# EAGLE board POE_REGULADORES (EAGLE 9.6.2)
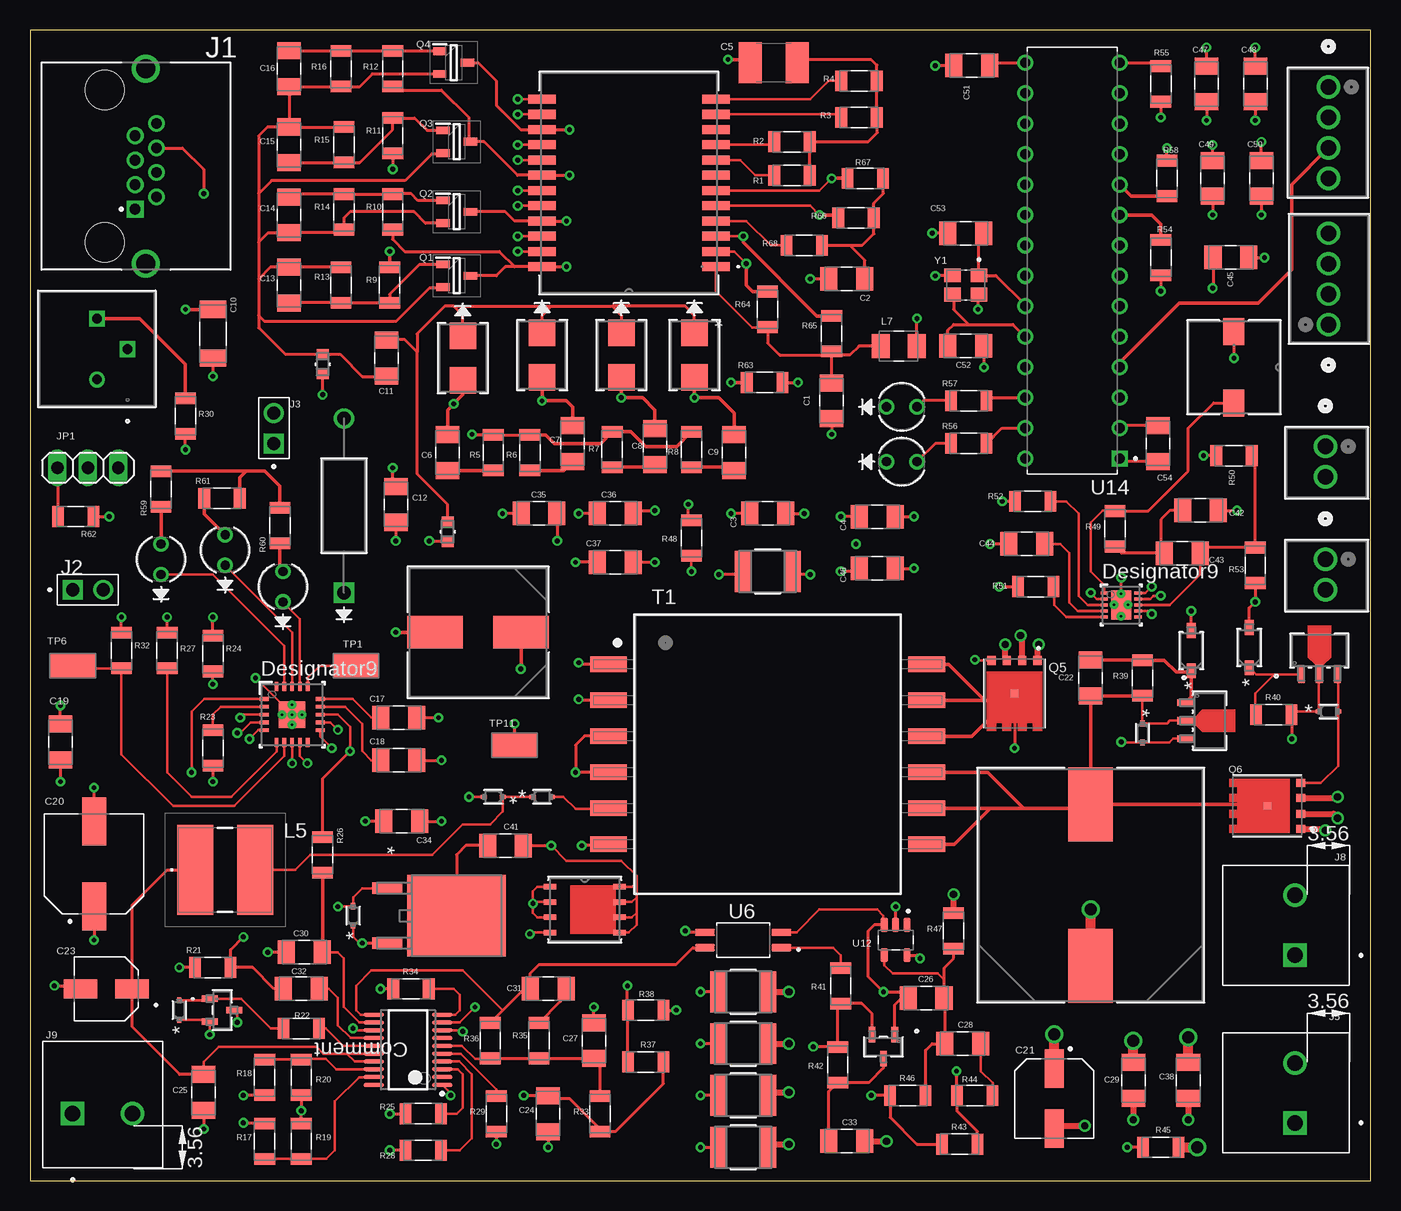
[diagram p5: board, top side]
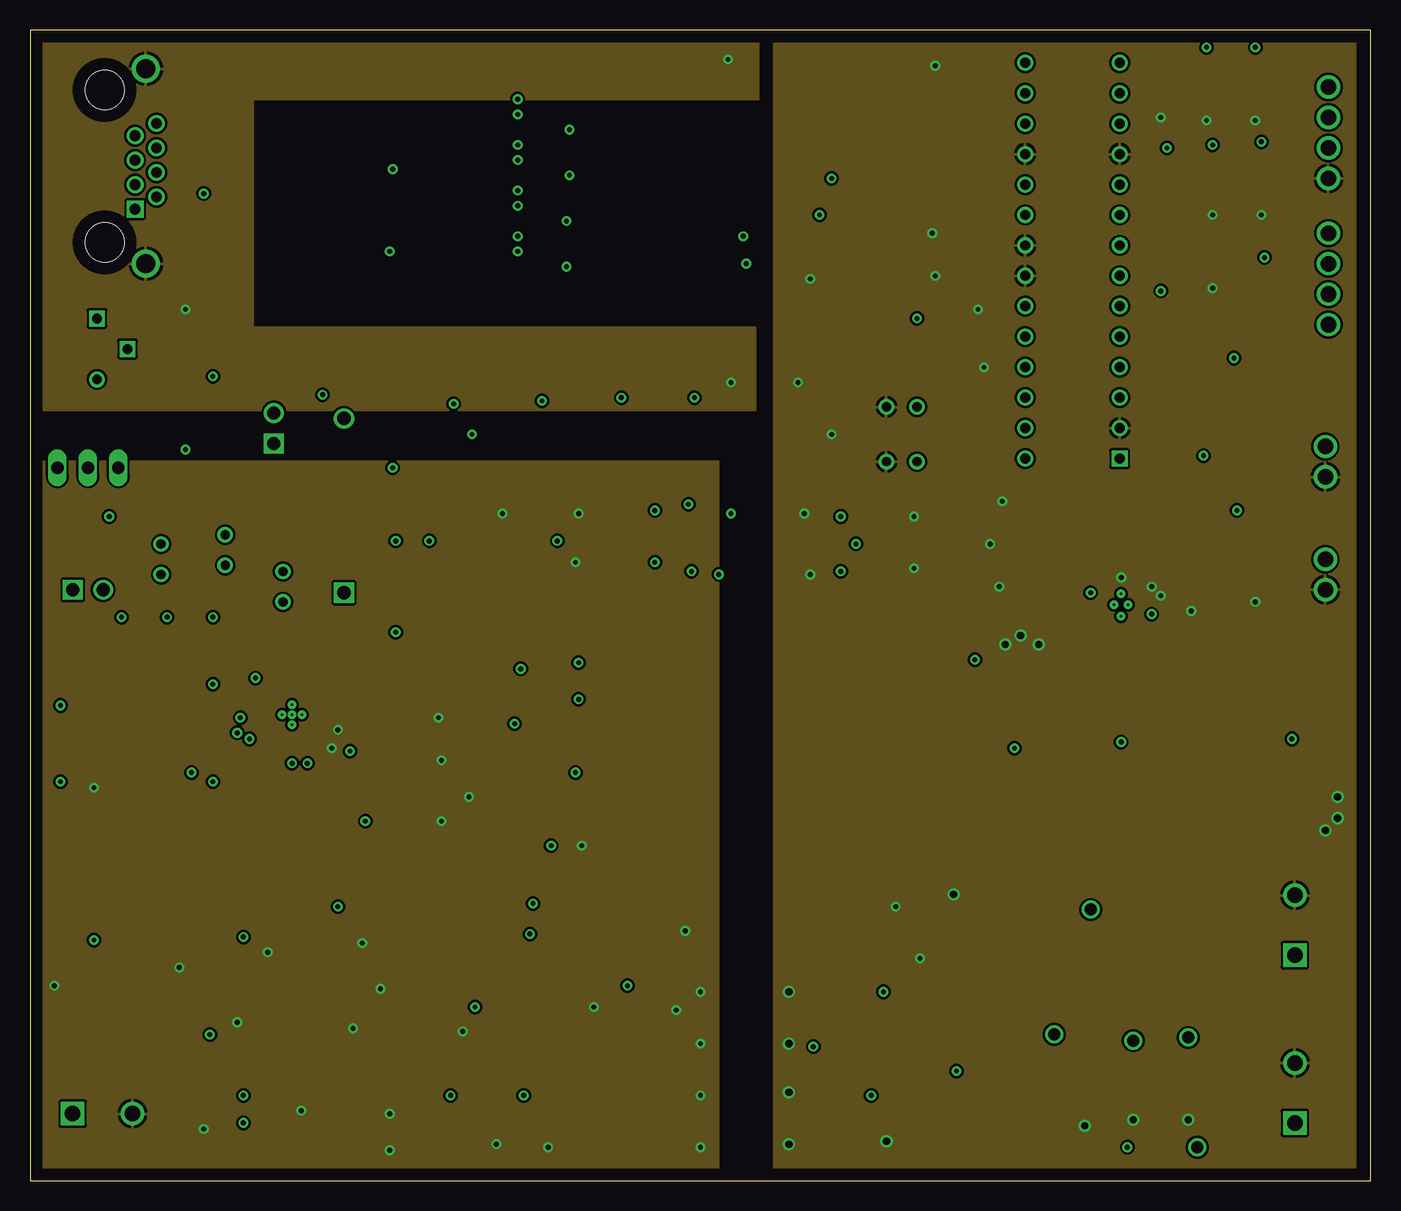
[diagram p6: board, inner layer Route2]
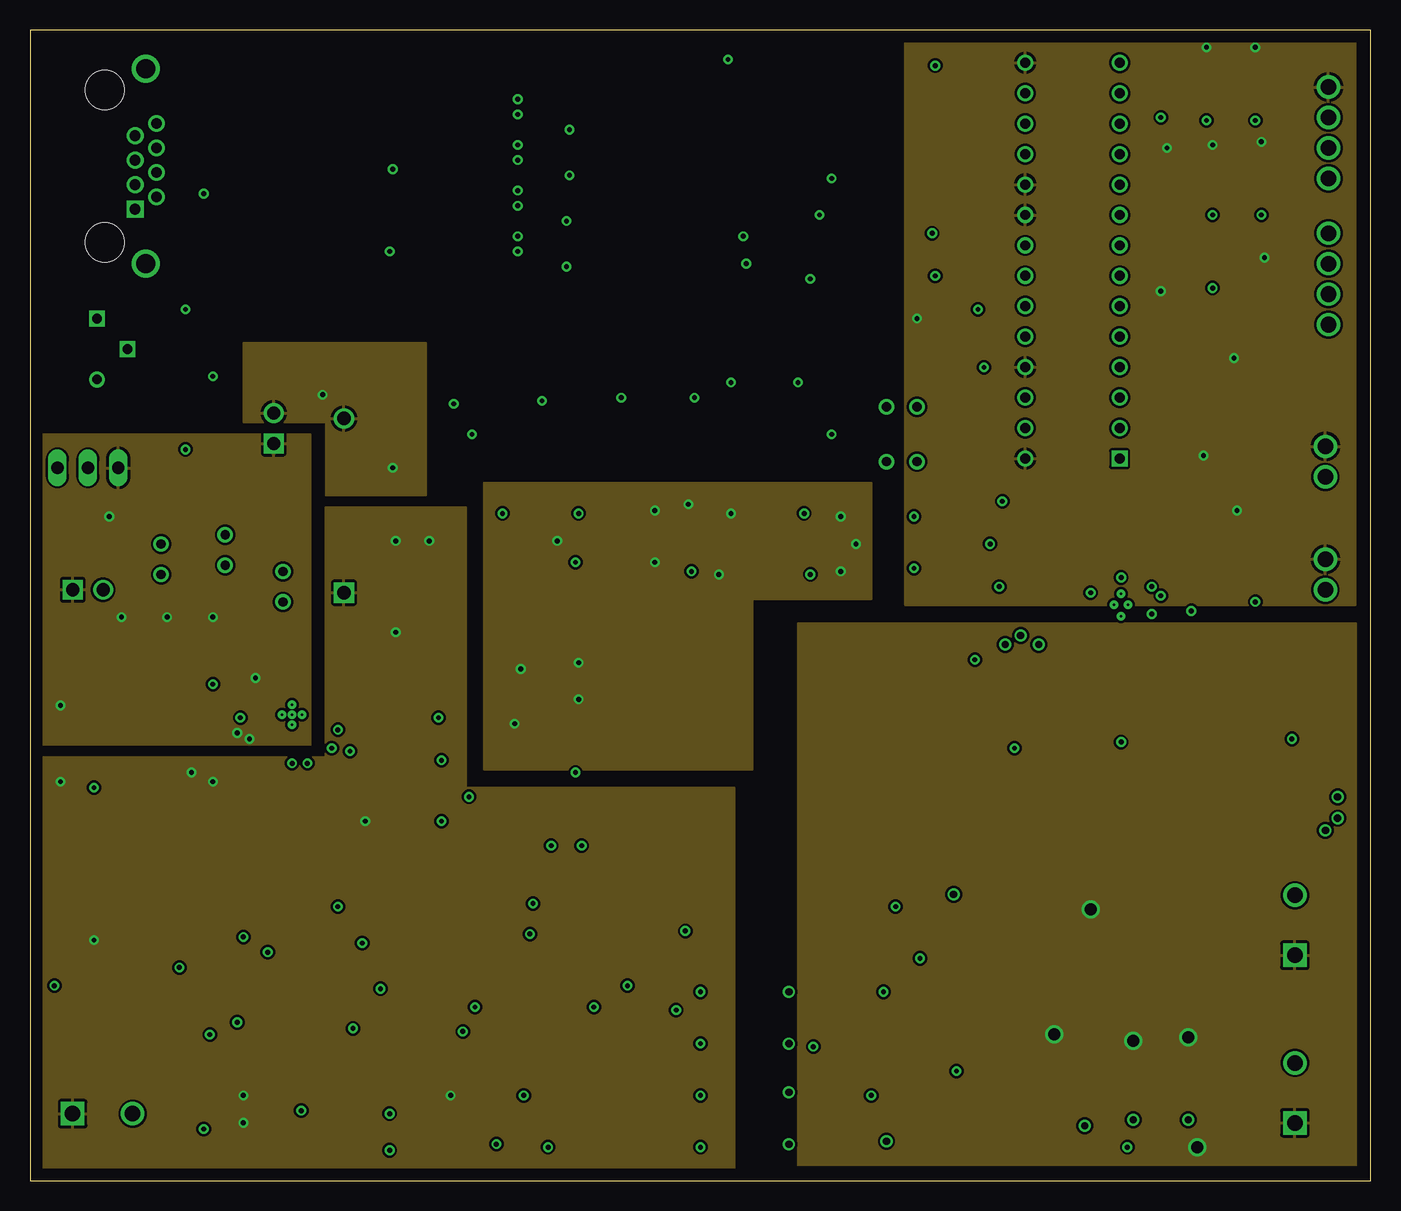
[diagram p7: board, inner layer Route15]
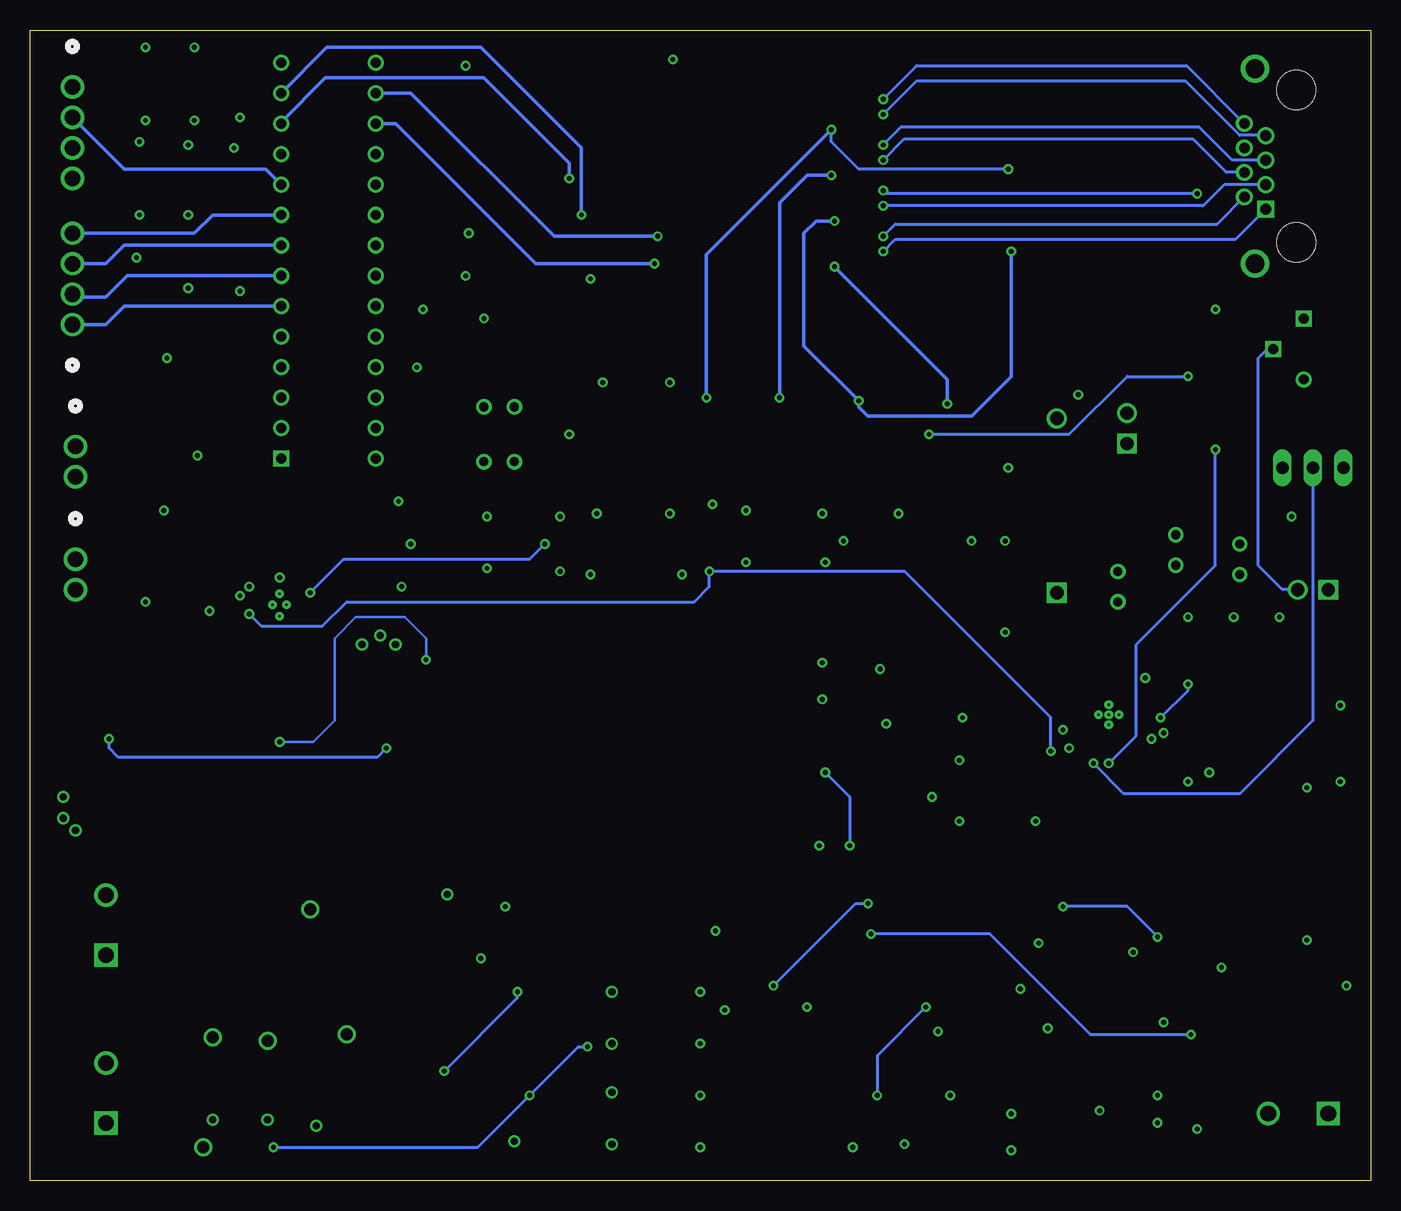
[diagram p8: board, bottom side, seen from below]

Size 111.74 x 95.94 mm. Coordinates in mm from the lower left corner, seen from the top.
Outline: 0,0 111.74,0 111.74,95.94 0,95.94 0,0
Copper layers (1+2*15+16): Top 0.035mm / dielectric 1.5mm / Route2 0.035mm / dielectric 0.15mm / Route15 0.035mm / dielectric 0.2mm / Bottom 0.035mm
Design rules "default *": minimum track width 8mil, minimum drill 0.4mm, track to track 8mil, track to pad 6mil, pad to pad 6mil, via to via 16mil, smd to smd 6mil, copper to edge 40mil, drill to drill 6mil, minimum pad ring 10mil, minimum via ring 8mil, stop-mask expansion 4mil, vias tented up to drill 0mil, thermal gap 10mil

## Footprints (pad centres in the part's own frame; a part is rotated, then mirrored left to right if it is on the bottom)
CAPC3316X98N = smd 1.42 x 1.96: 1 -1.492,0; 2 1.492,0
C4532 = smd 1.9 x 3.4: 1 -1.95,0; 2 1.95,0
CAPC4520X150N = smd 1.45 x 2.22: 1 -2.032,0; 2 2.032,0
CAP_EEEFK1J470P = smd 4 x 2: 1 -3.55,0; 2 3.55,0
CAP_EEEFK1C470P = smd 3.2 x 1.6: 1 -2.5,0; 2 2.5,0
CAP_EEEFK1E220R = smd 2.8 x 1.6: 1 -2.15,0; 2 2.15,0
CAP_1812_AVX = smd 1.376 x 3.4: 1 -2.068,0; 2 2.068,0
SOT-23_TO-236_DTC = smd 0.559 x 1.295: 1 -0.95,-1.003; 2 0.95,-1.003; 3 0,1.003
SMB_DIO = smd 2.18 x 2.21: 1 -1.857,0; 2 1.857,0
P6KESERIES_LTF = drill 1.118 pad 1.626 square: 1 0,0 | drill 1.118 pad 1.626: 2 14.529,0
SOD-523_0P9X1P3_ONS = smd 0.508 x 0.356: 1 -0.8,0; 2 0.8,0
CONN_1-406541-1 = drill 0.89 square: 1 3.58,-0.89 | drill 0.89: 2 2.56,0.89; 3 1.54,-0.89; 4 0.52,0.89; 5 -0.5,-0.89; 6 -1.52,0.89; 7 -2.54,-0.89; 8 -3.56,0.89 | drill 1.57: 9 -8.13,0; 10 8.13,0 | hole 3.25: -6.35,-3.43; 6.35,-3.43
WURTH_61300211121 = drill 1.1 pad 1.45 square: 01 -1.27,0 | drill 1.1 pad 1.45: 02 1.27,0
CONN_OSTVN04A150_OST = drill 1.295 pad 1.803: 1 0,0; 2 2.54,0; 3 5.08,0; 4 7.62,0
CUI_TB001-500-02BE = drill 1.3 square: 1 0,0.508 | drill 1.3: 2 5,0.508
CONN_OSTVN02A150_OST = drill 1.295 pad 1.803: 1 0,0; 2 2.54,0
1X03 = drill 1.016 long: 1 -2.54,0; 2 0,0; 3 2.54,0
IND_742792641_WRE = smd 0.864 x 0.991: 1 -0.826,0; 2 0.826,0
IND_1890_2-WE-HCI_WRE = smd 6.172 x 3.708: 1 -6.718,0; 2 6.718,0
IND_1050-WE-HCI_WRE = smd 4.648 x 2.692: 1 -3.581,0; 2 3.581,0
768775322 = smd 3 x 7.5: 1 -2.5,0; 2 2.5,0
IND_7345R_WE-PD_WRE = smd 2.261 x 1.753: 1 -2.972,0; 2 2.972,0
INDM3225X210N = smd 1.51 x 2.01: 1 -1.5,0; 2 1.5,0
BL-BGE1V1_AMB = drill 0.762 pad 1.27: 1 0,0; 2 2.54,0
SOT95P251X112-3N = smd 1.1 x 0.65: 1 -1.15,0.95; 2 -1.15,-0.95; 3 1.15,0
TRANS_CSD18533Q5A = smd 0.75 x 0.675: 1 -2.752,1.917; 2 -2.752,0.66; 3 -2.752,-0.66; 4 -2.752,-1.917 | smd 0.6 x 0.6: 5 0,0
RESC3116X65N = smd 0.97 x 1.73: 1 -1.48,0; 2 1.48,0
POT_3386P = drill 0.813 pad 1.321: 1 0,0 | drill 0.813 pad 1.321 square: 2 2.54,-2.54; 3 5.08,0
WE-POE++_EFD20_L29.65W21.8H11.43 = smd 3.05 x 1.27: 1 -13.26,7.5; 2 -13.26,4.5; 3 -13.26,1.5; 4 -13.26,-1.5; 5 -13.26,-4.5; 6 -13.26,-7.5; 7 13.26,-7.5; 8 13.26,-4.5; 9 13.26,-1.5; 10 13.26,1.5; 11 13.26,4.5; 12 13.26,7.5
KEYSTONE_5019 = smd 3.8 x 2.03: TP 0,0
7490220122_WRE = smd 2.286 x 0.762: 1 0,0; 2 0,-1.27; 3 0,-2.54; 4 0,-3.81; 5 0,-5.08; 6 0,-6.35; 7 0,-7.62; 8 0,-8.89; 9 0,-10.16; 10 0,-11.43; 11 0,-12.7; 12 0,-13.97; 13 14.48,-13.97; 14 14.48,-12.7; 15 14.48,-11.43; 16 14.48,-10.16; 17 14.48,-8.89; 18 14.48,-7.62; 19 14.48,-6.35; 20 14.48,-5.08; 21 14.48,-3.81; 22 14.48,-2.54; 23 14.48,-1.27; 24 14.48,0
RGW0020B = smd 0.75 x 0.31: 1 -2.325,1.3; 2 -2.325,0.65; 3 -2.325,0; 4 -2.325,-0.65; 5 -2.325,-1.3; 11 2.325,-1.3; 12 2.325,-0.65; 13 2.325,0; 14 2.325,0.65; 15 2.325,1.3 | smd 0.31 x 0.75: 6 -1.3,-2.325; 7 -0.65,-2.325; 8 0,-2.325; 9 0.65,-2.325; 10 1.3,-2.325; 16 1.3,2.325; 17 0.65,2.325; 18 0,2.325; 19 -0.65,2.325; 20 -1.3,2.325 | smd 2.2 x 2.2: 21 0,0 | drill 0.203 pad 0.508: V 0,-0.838; V_1 0.838,0; V_2 0,0; V_3 -0.838,0; V_4 0,0.838
PW0020A = smd 1.7 x 0.35: 1 -2.85,2.925; 2 -2.85,2.275; 3 -2.85,1.625; 4 -2.85,0.975; 5 -2.85,0.325; 6 -2.85,-0.325; 7 -2.85,-0.975; 8 -2.85,-1.625; 9 -2.85,-2.275; 10 -2.85,-2.925; 11 2.85,-2.925; 12 2.85,-2.275; 13 2.85,-1.625; 14 2.85,-0.975; 15 2.85,-0.325; 16 2.85,0.325; 17 2.85,0.975; 18 2.85,1.625; 19 2.85,2.275; 20 2.85,2.925
SOD-123_ONS = smd 1.219 x 0.762: 1 -1.676,0; 2 1.676,0
FCX493TA_DIO = smd 0.533 x 1.397: 1 -1.5,-1.994; 3 1.5,-1.994 | smd 0.61 x 1.397: 2 0,-1.994
SOIC127P700X230-4N = smd 1.64 x 0.59: 1 -3.185,0.635; 2 -3.185,-0.635; 3 3.185,-0.635; 4 3.185,0.635
SOT-23-3_1P4X3P040_ONS = smd 0.559 x 1.321: 1 -0.953,-1.016; 2 0.953,-1.016; 3 0,1.016
FDMS_86250_ONS = smd 1.067 x 0.457: 1 -2.896,1.905; 2 -2.896,0.635; 3 -2.896,-0.635; 4 -2.896,-1.905; 5 2.896,-1.905; 6 2.896,-0.635; 7 2.896,0.635; 8 2.896,1.905
DPAK_VIS = smd 0.94 x 2.489: 1 -2.29,-5.779; 3 2.29,-5.779 | smd 6.782 x 8.204: 2 0,0
SOT95P280X145-5N = smd 1.21 x 0.59: 1 -1.255,0.95; 2 -1.255,0; 3 -1.255,-0.95; 4 1.255,-0.95; 5 1.255,0.95
DRC0010J = smd 0.6 x 0.24: 1 -1.4,1; 2 -1.4,0.5; 3 -1.4,0; 4 -1.4,-0.5; 5 -1.4,-1; 6 1.4,-1; 7 1.4,-0.5; 8 1.4,0; 9 1.4,0.5; 10 1.4,1 | smd 1.65 x 2.4: 11 0,0 | drill 0.203 pad 0.508: V 0,-0.94; V_1 0,0.94; V_2 0.584,0; V_3 -0.584,0
DIP787W45P254L3556H508Q28 = drill 0.83 pad 1.25 square: 1 -3.937,16.51 | drill 0.83 pad 1.25: 2 -3.937,13.97; 3 -3.937,11.43; 4 -3.937,8.89; 5 -3.937,6.35; 6 -3.937,3.81; 7 -3.937,1.27; 8 -3.937,-1.27; 9 -3.937,-3.81; 10 -3.937,-6.35; 11 -3.937,-8.89; 12 -3.937,-11.43; 13 -3.937,-13.97; 14 -3.937,-16.51; 15 3.937,-16.51; 16 3.937,-13.97; 17 3.937,-11.43; 18 3.937,-8.89; 19 3.937,-6.35; 20 3.937,-3.81; 21 3.937,-1.27; 22 3.937,1.27; 23 3.937,3.81; 24 3.937,6.35; 25 3.937,8.89; 26 3.937,11.43; 27 3.937,13.97; 28 3.937,16.51
XTAL_TSX-3225_25.0000MF10P-C3 = smd 1.15 x 1.4: 1 -0.8,1.1; 2 -0.8,-1.1; 3 0.8,-1.1; 4 0.8,1.1

## Placement (x,y rotation side)
C1  0.1uF  [CAPC3316X98N]  66.8,65.02 270 top
C2  0.1uF  [CAPC3316X98N]  68.07,75.18 180 top
C3  0.1uF  [CAPC3316X98N]  61.47,55.63 180 top
C4  2.2uF  [CAPC3316X98N]  70.61,55.37 180 top
C5  4700pF  [C4532]  61.98,93.22 0 top
C6  0.01uF  [CAPC3316X98N]  34.8,60.71 90 top
C7  0.01uF  [CAPC3316X98N]  45.21,61.47 90 top
C8  0.01uF  [CAPC3316X98N]  52.07,61.21 90 top
C9  0.01uF  [CAPC3316X98N]  58.67,60.71 90 top
C10  1000pF  [CAPC4520X150N]  15.24,70.61 270 top
C11  1000pF  [CAPC3316X98N]  29.72,68.58 90 top
C12  1000pF  [CAPC3316X98N]  30.48,56.39 270 top
C13  300pF  [CAPC3316X98N]  21.59,74.68 270 top
C14  300pF  [CAPC3316X98N]  21.59,80.52 90 top
C15  300pF  [CAPC3316X98N]  21.59,86.36 270 top
C16  300pF  [CAPC3316X98N]  21.59,92.71 90 top
C17  0.1uF  [CAPC3316X98N]  30.73,38.61 180 top
C18  1uF  [CAPC3316X98N]  30.73,35.05 180 top
C19  0.1uF  [CAPC3316X98N]  2.54,36.58 270 top
C20  100uF  [CAP_EEEFK1J470P]  5.33,26.42 90 top
C21  47uF  [CAP_EEEFK1C470P]  85.34,6.86 270 top
C22  100pF  [CAPC3316X98N]  88.39,41.91 270 top
C23  22uF 25V  [CAP_EEEFK1E220R]  6.35,16 180 top
C24  47pF  [CAPC3316X98N]  43.18,5.59 90 top
C25  1uF  [CAPC3316X98N]  14.48,7.37 90 top
C26  100pF  [CAPC3316X98N]  74.68,15.24 0 top
C27  1uF  [CAPC3316X98N]  46.99,11.68 90 top
C28  3900pF  [CAPC3316X98N]  77.72,11.43 180 top
C29  22uF  [CAPC3316X98N]  91.95,8.38 90 top
C30  0.01uF  [CAPC3316X98N]  22.86,19.05 0 top
C31  0.068uF  [CAPC3316X98N]  43.18,16 0 top
C32  1uF  [CAPC3316X98N]  22.61,16 180 top
C33  1uF  [CAPC3316X98N]  68.07,3.3 180 top
C34  2.2uF  [CAPC3316X98N]  30.99,29.97 180 top
C35  2.2uF  [CAPC3316X98N]  42.42,55.63 0 top
C36  2.2uF  [CAPC3316X98N]  48.77,55.63 0 top
C37  2.2uF  [CAPC3316X98N]  48.77,51.56 0 top
C38  22uF  [CAPC3316X98N]  96.52,8.38 90 top
C39  1000pF  [CAP_1812_AVX]  59.44,2.79 0 top
C40  4700pF  [CAP_1812_AVX]  61.47,50.8 180 top
C41  0.047uF  [CAPC3316X98N]  39.62,27.94 0 top
C42  2200pF  [CAPC3316X98N]  97.54,55.88 0 top
C43  0.01uF  [CAPC3316X98N]  96.01,52.32 180 top
C44  0.022uF  [CAPC3316X98N]  83.06,53.09 0 top
C45  22uF  [CAPC3316X98N]  100.08,76.96 0 top
C46  2.2uF  [CAPC3316X98N]  70.61,51.05 180 top
C47  100nF  [CAPC3316X98N]  98.04,91.44 90 top
C48  100nF  [CAPC3316X98N]  102.11,91.44 90 top
C49  100nF  [CAPC3316X98N]  98.55,83.57 90 top
C50  100nF  [CAPC3316X98N]  102.62,83.57 90 top
C51  100nF  [CAPC3316X98N]  78.49,92.96 0 top
C52  18pF  [CAPC3316X98N]  77.98,69.6 180 top
C53  18pF  [CAPC3316X98N]  77.98,78.99 0 top
C54  10uF  [CAPC3316X98N]  93.98,61.47 270 top
C55  4700pF  [CAP_1812_AVX]  59.44,7.11 0 top
C56  4700pF  [CAP_1812_AVX]  59.44,11.43 0 top
C57  4700pF  [CAP_1812_AVX]  59.44,15.75 0 top
CR1  BAT54S  [SOT-23_TO-236_DTC]  71.12,11.18 180 top
D1  B2100-13-F  [SMB_DIO]  36.07,68.58 270 top
D2  B2100-13-F  [SMB_DIO]  42.67,68.83 270 top
D3  B2100-13-F  [SMB_DIO]  49.28,68.83 270 top
D4  B2100-13-F  [SMB_DIO]  55.37,68.83 270 top
D5  P6KE100A  [P6KESERIES_LTF]  26.16,49.02 90 top
D8  NSD914XV2T1G  [SOD-523_0P9X1P3_ONS]  92.71,37.34 270 top
D9  NSD914XV2T1G  [SOD-523_0P9X1P3_ONS]  108.2,39.12 0 top
D10  NSD914XV2T1G  [SOD-523_0P9X1P3_ONS]  42.67,32 0 top
D11  NSD914XV2T1G  [SOD-523_0P9X1P3_ONS]  38.61,32 180 top
D12  NSD914XV2T1G  [SOD-523_0P9X1P3_ONS]  26.92,22.1 90 top
D13  NSD914XV2T1G  [SOD-523_0P9X1P3_ONS]  12.45,14.22 90 top
J1  1-406541-1  [CONN_1-406541-1]  9.65,84.58 270 top
J2  AMPS_Connect  [WURTH_61300211121]  4.83,49.28 0 top
J3  Port Current  [WURTH_61300211121]  20.32,62.74 90 top
J4  OSTVN04A150  [CONN_OSTVN04A150_OST]  108.2,91.19 270 top
J5  TB001-500-02BE  [CUI_TB001-500-02BE]  105.92,4.83 90 top
J6  OSTVN02A150  [CONN_OSTVN02A150_OST]  107.95,51.82 270 top
J7  OSTVN02A150  [CONN_OSTVN02A150_OST]  107.95,61.21 270 top
J8  TB001-500-02BE  [CUI_TB001-500-02BE]  105.92,18.8 90 top
J9  TB001-500-02BE  [CUI_TB001-500-02BE]  3.56,5.08 0 top
J10  OSTVN04A150  [CONN_OSTVN04A150_OST]  108.2,71.37 90 top
JP1  CONN_MPS_DUTY  [1X03]  4.83,59.44 0 top
L1  742792641  [IND_742792641_WRE]  34.8,54.1 90 top
L2  742792641  [IND_742792641_WRE]  24.38,68.07 90 top
L3  15uH  [IND_1890_2-WE-HCI_WRE]  88.39,24.64 90 top
L4  5.5uH  [IND_1050-WE-HCI_WRE]  37.34,45.72 180 top
L5  768775322  [768775322]  16.26,25.91 0 top
L6  7447779233  [IND_7345R_WE-PD_WRE]  100.33,67.82 270 top
L7  10uH  [INDM3225X210N]  72.39,69.6 0 top
LED1  BL-BGE1V1  [BL-BGE1V1_AMB]  16.26,51.31 90 top
LED2  BL-BGE1V1  [BL-BGE1V1_AMB]  21.08,48.26 90 top
LED3  BL-BGE1V1  [BL-BGE1V1_AMB]  10.92,50.55 90 top
LED4  BL-BGE1V1  [BL-BGE1V1_AMB]  71.37,59.94 0 top
LED5  BL-BGE1V1  [BL-BGE1V1_AMB]  71.37,64.52 0 top
Q1  FDN8601  [SOT95P251X112-3N]  35.56,75.44 0 top
Q2  FDN8601  [SOT95P251X112-3N]  35.56,80.77 0 top
Q3  FDN8601  [SOT95P251X112-3N]  35.56,86.61 0 top
Q4  FDN8601  [SOT95P251X112-3N]  35.31,93.22 0 top
Q5  CSD18533Q5A  [TRANS_CSD18533Q5A]  82.04,40.64 270 top
Q6  CSD18533Q5A  [TRANS_CSD18533Q5A]  103.12,31.24 180 top
R1  75ohm  [RESC3116X65N]  63.5,83.82 0 top
R2  75ohm  [RESC3116X65N]  63.5,86.61 0 top
R3  75ohm  [RESC3116X65N]  69.09,88.65 0 top
R4  75ohm  [RESC3116X65N]  69.09,91.69 0 top
R5  75ohm  [RESC3116X65N]  38.61,60.71 270 top
R6  75ohm  [RESC3116X65N]  41.66,60.71 270 top
R7  75ohm  [RESC3116X65N]  48.51,60.96 270 top
R8  75ohm  [RESC3116X65N]  55.12,60.96 270 top
R9  1M  [RESC3116X65N]  29.97,74.68 90 top
R10  1M  [RESC3116X65N]  30.23,80.77 270 top
R11  1M  [RESC3116X65N]  30.23,87.12 270 top
R12  1M  [RESC3116X65N]  30.23,92.71 270 top
R13  232K  [RESC3116X65N]  25.91,74.68 270 top
R14  232K  [RESC3116X65N]  26.16,80.77 90 top
R15  232K  [RESC3116X65N]  26.16,86.36 270 top
R16  232K  [RESC3116X65N]  25.91,92.71 90 top
R17  121K  [RESC3116X65N]  19.56,3.3 270 top
R18  121K  [RESC3116X65N]  19.56,8.64 90 top
R19  2.32K  [RESC3116X65N]  22.61,3.3 270 top
R20  4.22K  [RESC3116X65N]  22.61,8.64 90 top
R21  10K  [RESC3116X65N]  15.24,17.78 0 top
R22  10  [RESC3116X65N]  22.61,12.7 180 top
R23  27.4K  [RESC3116X65N]  15.24,36.07 90 top
R24  63.4  [RESC3116X65N]  15.24,43.94 270 top
R25  6.98K  [RESC3116X65N]  32.77,5.59 180 top
R26  0  [RESC3116X65N]  24.38,27.18 270 top
R27  249  [RESC3116X65N]  11.43,44.2 270 top
R28  80.6K  [RESC3116X65N]  32.77,2.54 180 top
R29  61.9K  [RESC3116X65N]  38.86,5.59 270 top
R30  1K  [RESC3116X65N]  12.95,63.75 270 top
R31  2k  [POT_3386P]  5.59,66.8 90 top
R32  49.9K  [RESC3116X65N]  7.62,44.2 270 top
R33  51.1K  [RESC3116X65N]  47.5,5.59 270 top
R34  100K  [RESC3116X65N]  31.75,16 0 top
R35  499  [RESC3116X65N]  42.42,11.68 270 top
R36  2K  [RESC3116X65N]  38.35,11.68 270 top
R37  1K  [RESC3116X65N]  51.31,9.91 180 top
R38  0.05  [RESC3116X65N]  51.31,14.22 180 top
R39  2K  [RESC3116X65N]  92.71,41.91 270 top
R40  2K  [RESC3116X65N]  103.63,38.86 0 top
R41  2K  [RESC3116X65N]  67.56,16.26 270 top
R42  10K  [RESC3116X65N]  67.31,9.65 90 top
R43  2K  [RESC3116X65N]  77.47,3.05 180 top
R44  1K  [RESC3116X65N]  78.74,7.11 180 top
R45  0  [RESC3116X65N]  94.23,2.79 0 top
R46  40.2K  [RESC3116X65N]  73.15,7.11 180 top
R47  10.5K  [RESC3116X65N]  76.96,20.83 270 top
R48  49.9K  [RESC3116X65N]  55.12,53.59 90 top
R49  301K  [RESC3116X65N]  90.42,54.36 270 top
R50  10K  [RESC3116X65N]  100.33,60.45 180 top
R51  105K  [RESC3116X65N]  83.82,49.53 0 top
R52  24.9K  [RESC3116X65N]  83.57,56.64 0 top
R53  5.76K  [RESC3116X65N]  102.11,51.31 90 top
R54  100K  [RESC3116X65N]  94.23,76.96 270 top
R55  2.2K  [RESC3116X65N]  94.23,91.44 90 top
R56  470  [RESC3116X65N]  78.23,61.47 0 top
R57  470  [RESC3116X65N]  78.23,65.02 0 top
R58  10K  [RESC3116X65N]  94.74,83.57 270 top
R59  3.74K  [RESC3116X65N]  10.92,57.66 90 top
R60  3.74K  [RESC3116X65N]  20.83,54.61 90 top
R61  3.74K  [RESC3116X65N]  16,56.9 0 top
R62  53.6k  [RESC3116X65N]  3.81,55.37 180 top
R63  0  [RESC3116X65N]  61.21,66.55 0 top
R64  49.9ohm  [RESC3116X65N]  61.47,72.64 270 top
R65  49.9ohm  [RESC3116X65N]  66.8,70.61 270 top
R66  49.9ohm  [RESC3116X65N]  68.83,80.26 0 top
R67  49.9ohm  [RESC3116X65N]  69.6,83.57 0 top
R68  0  [RESC3116X65N]  64.52,77.98 0 top
T1  750313355  [WE-POE++_EFD20_L29.65W21.8H11.43]  61.47,35.56 0 top
TP1  UVLO_SEL  [KEYSTONE_5019]  27.18,42.93 0 top
TP6  REF  [KEYSTONE_5019]  3.56,42.93 0 top
TP11  VDD_P  [KEYSTONE_5019]  40.39,36.32 0 top
U1  7490220122  [7490220122_WRE]  57.15,76.2 180 top
U2  TPS2373-3RGWT  [RGW0020B]  21.84,38.86 0 top
U3  UCC2897APW  [PW0020A]  31.5,10.92 180 top
U4  12V  [SOD-123_ONS]  96.77,44.2 90 top
U5  FCX493TA  [FCX493TA_DIO]  98.3,38.35 270 top
U6  TCMT1107  [SOIC127P700X230-4N]  59.44,20.07 180 top
U7  MMBT3906  [SOT-23-3_1P4X3P040_ONS]  16,14.22 270 top
U8  FDMS86250  [FDMS_86250_ONS]  46.23,22.61 0 top
U9  IRFR9220PBF  [DPAK_VIS]  35.56,22.1 270 top
U10  12V  [SOD-123_ONS]  101.6,44.45 90 top
U11  FCX493TA  [FCX493TA_DIO]  107.44,44.2 0 top
U12  TL431AIDBVR  [SOT95P280X145-5N]  72.14,20.07 270 top
U13  LM5165DRCR  [DRC0010J]  90.93,48.01 0 top
U14  ENC28J60-I/SP  [DIP787W45P254L3556H508Q28]  86.87,76.71 180 top
Y1  Crystal_25Mhz  [XTAL_TSX-3225_25.0000MF10P-C3]  77.98,74.68 270 top

## Tracks (layer width: path | path; a pad name or v marks a point on that pad's centre or on a via)
+3V3  (via drill 0.4)
  Top 0.254: C48.2 v102.11,94.49 | C47.2 v98.04,94.49 | R58.1 v94.74,86.11 | C49.2 v98.55,86.36 | C50.2 v102.62,86.61 | C45.2 v102.87,76.96 | L6.1 v100.33,68.58 | R54.2 v94.23,74.17 | R50.2 v97.79,60.45 | C42.2 v100.58,55.88 | C51.2 80.23,93.22 U14.15 | L7.2 73.89,71.86 v73.91,71.88
  pour Route15: 72.9,95.5 72.9,48.01 110.49,48.01 110.49,95.5
+12V  (via drill 1)
  Top 0.813: R45.2 v97.28,2.79 | C38.2 v96.52,11.94 | C29.2 v91.95,11.68 | C21.1 v85.34,12.19 | L3.1 v88.39,22.61
  pour Route15: 110.49,46.48 110.49,1.27 64.01,1.27 64.01,46.48
AUX
  Top 0.203: U3.14 26.71,11.9 25.65,12.95 25.65,15.24 24.89,16 C32.1
BSVG  (via drill 0.4)
  Top 0.305: v58.17,93.47 59.77,93.47 C5.1 | C10.1 v12.95,72.64 | R63.1 v58.42,66.55
  pour Route2: 60.45,64.26 0.76,64.26 0.76,95.5 60.71,95.5 60.71,90.17 18.54,90.17 18.54,71.12 60.45,71.12
BT_N
  Top 0.203: U2.19 21.19,44.59 15.24,50.55 LED3.1
CS
  Top 0.305: U14.9 93.47,80.52 94.23,79.76 R54.1
  Bottom 0.305: U14.9 96.52,80.52 98.04,78.99 J10.4
GND  (via drill 0.4, 0.6)
  Top 0.203: U13.9 93.35,48.51 93.61,48.77 v94.23,48.77 | U13.10 92.95,49.01 v93.47,49.53
  Top 0.254: U4.2 v96.77,47.5 | U10.2 101.6,47.75 v102.11,48.26 R53.1 | v80.77,49.53 R51.1 | C54.1 91.03,62.96 U14.2 | C45.1 98.58,74.45 v98.55,74.42 | C49.1 v98.55,80.52 | C50.1 v102.62,80.52 | C48.1 v102.11,88.39 | C47.1 v98.04,88.39 | R55.1 v94.23,88.65 | C53.1 v75.18,78.99 | Y1.2 76.84,75.44 v75.44,75.44 | Y1.4 78.99,73.79 v78.99,72.64 | C52.1 79.47,67.85 v79.5,67.82 | C1.2 v66.8,62.23 | C44.1 v80.01,53.09 | R52.1 v81.03,56.64 | C51.1 v75.44,92.96 | C2.2 v65.02,75.18 | U12.2 v72.14,22.86 | U12.5 73.9,18.81 v74.17,18.54 | C3.1 v64.52,55.63 | v65.02,50.55 63.79,50.55 C40.1 | C4.1 v73.66,55.37 | C46.1 v73.66,51.05 | R63.2 v64.01,66.55 | U13.11 v90.93,50.29 | v90.93,50.29
  Top 0.508: C57.2 v63.25,15.75 | C56.2 v63.25,11.43 | C55.2 61.76,7.37 v63.25,7.37 | C39.2 61.76,3.05 v63.25,3.05 | C33.1 v71.37,3.3 | C21.2 85.56,4.57 v87.88,4.57 | C29.1 v91.95,5.08 | C38.1 v96.52,5.08 | R47.1 v76.96,23.88 | Q5.3 81.28,43.49 v81.28,44.7 | Q5.2 82.7,45.31 v82.55,45.47 | Q5.1 83.96,44.59 v84.07,44.7 | v108.97,32 108.86,31.9 Q6.3 | Q6.1 107.83,29.32 v107.95,29.21 | v108.97,30.23 108.61,30.58 Q6.2
  pour Route2: 110.49,95.5 61.98,95.5 61.98,1.02 110.49,1.02
LEDA
  Top 0.254: R56.2 80.98,62.74 U14.27
LEDB
  Top 0.254: R57.2 79.97,65.28 U14.26
MPS_DUTY  (via drill 0.4)
  Top 0.203: U2.9 22.49,35.42 v23.11,34.8
  Bottom 0.254: JP1.2 4.83,38.35 10.92,32.26 20.57,32.26 v23.11,34.8
N$1  (via drill 0.4)
  Top 0.203: U1.23 v40.64,77.47
  Bottom 0.254: J1.1 11.28,78.49 39.62,78.49 v40.64,77.47
N$2  (via drill 0.4)
  Top 0.203: U1.22 v40.64,78.74
  Bottom 0.254: J1.2 12.81,79.76 39.62,79.76 v40.64,78.74
N$3  (via drill 0.4)
  Top 0.203: U1.20 v40.64,81.28
  Bottom 0.254: J1.3 12.21,83.04 13.97,81.28 v40.64,81.28
N$4  (via drill 0.4)
  Top 0.203: U1.17 v40.64,85.09
  Bottom 0.254: J1.4 12.07,84.06 14.86,86.86 38.87,86.86 v40.64,85.09
N$5  (via drill 0.4)
  Top 0.203: U1.16 v40.64,86.36
  Bottom 0.254: v40.64,86.36 39.12,87.88 14.35,87.88 11.56,85.08 J1.5
N$6  (via drill 0.4)
  Top 0.203: U1.19 v40.64,82.55
  Top 0.254: J1.6 12.7,86.1 14.48,84.33 v14.48,82.3
  Bottom 0.254: v14.48,82.3 40.39,82.3 v40.64,82.55
N$7  (via drill 0.4)
  Top 0.203: U1.14 v40.64,88.9
  Bottom 0.254: J1.7 8.8,87.16 10.95,87.16 15.48,91.69 37.85,91.69 v40.64,88.9
N$8  (via drill 0.4)
  Top 0.203: U1.13 v40.64,90.17
  Bottom 0.254: J1.8 15.36,92.96 37.85,92.96 v40.64,90.17
N$9
  Top 0.254: C14.2 21.83,82.25 R14.2 R10.1 30.27,82.3 31.75,82.3 32.32,81.72 Q2.1
N$10
  Top 0.305: R59.1 LED3.2
N$11
  Top 0.305: C6.1 38.6,59.21 R5.2
N$12
  Top 0.305: R6.2 44.46,59.23 C7.1
N$13
  Top 0.305: R7.2 51.83,59.48 C8.1
N$14
  Top 0.305: R8.2 58.41,59.48 C9.1
N$15  (via drill 0.4)
  Top 0.254: R6.1 R5.1 36.87,62.19 v36.83,62.23 | C10.2 v15.24,67.06
  Top 0.305: R6.1 42.97,62.19 43.69,61.47 47.54,61.47 R7.1 50.08,62.44 51.31,61.21 53.89,61.21 R8.1
  Bottom 0.254: v36.83,62.23 25.15,62.23 20.32,67.06 v15.24,67.06
N$16
  Top 0.203: U1.8 59.18,85.09 60.45,83.82 R1.1
N$17
  Top 0.254: R1.2 R2.2 69.85,86.61 70.61,87.38 70.61,88.6 R3.2 R4.2 70.57,93.01 70.1,93.47 64.18,93.47 C5.2
N$18
  Top 0.203: U1.9 61.77,86.36 R2.1
N$19
  Top 0.203: U1.11 67.35,88.9 R3.1
N$20
  Top 0.203: U1.12 65.02,90.17 66.55,91.69 R4.1
N$21
  Top 0.254: C13.2 21.6,73.2 R13.2 R9.1 29.97,73.91 32.45,76.39 Q1.1
N$22  (via drill 0.4)
  Top 0.203: U2.3 17.78,38.86 v17.53,38.61
  Top 0.254: v15.24,41.4 R24.2
  Bottom 0.254: v17.53,38.61 15.24,40.89 v15.24,41.4
N$23
  Top 0.203: U2.6 20.54,35.78 16.76,32 13.46,32 11.43,34.04 R27.2
N$24
  Top 0.203: U2.7 21.19,35.42 17.02,31.24 11.94,31.24 7.62,35.56 R32.2 3.77,42.72 TP6.TP
N$25
  Top 0.254: C15.2 26.15,84.87 R15.2 27.48,84.88 30.23,87.63 R11.1 32.05,88.6 33.09,87.56 Q3.1
N$26
  Top 0.305: R30.1 12.95,68.07 9.14,71.88 R31.3
N$27
  Bottom 0.254: J2.02 7.37,49.28 9.4,51.31 9.4,68.58 8.64,69.34 R31.2
N$28
  Top 0.254: C16.2 25.92,94.2 R16.2 R12.1 34.13,94.19 Q4.1
N$29
  Top 0.203: U2.2 15.89,39.51 15.24,38.86 R23.2
N$30
  Top 0.254: D1.1 36.07,72.14 35.31,72.9 | 32.26,69.09 31.24,70.1 29.75,70.1 C11.2 | L1.2 34.8,56.39 32.26,58.93 32.26,69.09 | D2.1 42.67,72.14 43.43,72.9 | 48.51,72.9 49.28,72.14 D3.1 | 43.43,72.9 48.51,72.9 | 35.31,72.9 43.43,72.9 | D4.1 55.37,72.14 54.61,72.9 48.51,72.9 | 35.31,72.9 34.54,72.9 32.26,70.61 32.26,69.09
N$31  (via drill 0.4)
  Top 0.203: U2.8 v21.84,34.8
  Top 0.254: v12.95,60.96 R30.2
  Bottom 0.254: v21.84,34.8 19.56,37.08 19.56,44.7 12.95,51.31 v12.95,60.96
N$32
  Top 0.203: U2.16 23.14,41.94 24.13,42.93 TP1.TP
N$33
  Top 0.203: D10.2 44.45,32 45.47,30.99 48.14,30.99 T1.5
N$34  (via drill 0.4)
  Top 0.203: U5.3 95.27,36.85 94.96,36.54 D8.2 90.97,36.54 v90.93,36.58 | Q5.4 78.78,43.39 v78.74,43.43
  Bottom 0.203: v90.93,36.58 88.14,36.58 86.36,38.35 86.36,45.21 84.58,46.99 80.52,46.99 78.74,45.21 v78.74,43.43
N$35
  Top 0.203: 92.7,40.42 92.7,38.15 D8.1 94.78,38.14 95,38.35 U5.2
  Top 0.305: L3.2 C22.2 92.7,40.42 R39.2 | T1.8 80.01,31.06 | 80.01,31.06 82.8,31.06 | 82.8,31.06 88.1,31.06 L3.2 | T1.9 79.8,34.06 82.8,31.06 | T1.7 77.01,28.06 80.01,31.06 | L3.2 103.01,31.36 Q6.5
N$36
  Top 0.254: 25.9,91.22 R16.1 | C15.1 C16.1 25.9,91.22 | C15.1 26.15,87.85 R15.1 | R13.1 21.6,76.16 C13.1 20.03,76.17 19.05,75.18 | Q4.2 28.51,92.27 27.43,91.19 25.93,91.19 25.9,91.22 | Q2.2 32.95,79.82 32,80.77 26.67,80.77 26.16,80.26 R14.1 25.9,79.03 C14.1 21.56,78.99 19.81,78.99 19.05,78.23 | C11.1 29.69,67.06 27.69,67.06 25.84,68.9 L2.2 21.27,68.9 19.05,71.12 19.05,72.14 | 19.05,75.18 19.05,72.14 | C15.1 19.78,87.85 19.05,87.12 19.05,82.3 | 19.05,82.3 19.05,78.23 | 19.05,78.23 19.05,75.18 | Q3.2 34.34,85.6 33.48,85.6 31.27,83.39 20.14,83.39 19.05,82.3 | Q1.2 34.34,74.42 33.27,74.42 30.48,71.63 19.56,71.63 19.05,72.14
N$37
  Top 0.203: D13.2 14.83,15.02 U7.1 17.59,15.18 20.07,12.7 R22.2
N$38
  Top 0.203: U12.4 71.19,17.97 71.88,17.27 75.66,17.27 76.17,16.76
  Top 0.254: R47.2 76.96,18.54 76.17,17.75 76.17,16.76 C26.2 76.23,15.18 C28.2 75.18,11.43 74.63,10.88 R46.1
N$39
  Top 0.203: U3.11 27.55,13.85 27.18,14.22 27.18,16.26 28.45,17.53 36.07,17.53 39.39,14.2
  Top 0.254: R36.1 39.39,14.2 41.19,16 C31.1 41.69,17.3 42.42,18.03 53.85,18.03 55.24,19.43 U6.4
N$40
  Top 0.254: R35.1 44.2,14.94 44.2,15.53 C31.2
N$41
  Top 0.203: U6.1 66.93,19.43 67.56,18.8 R41.1
N$42
  Top 0.203: R17.2 R19.2 24.68,1.82 25.4,2.54 25.4,6.6 27.43,8.64 28.64,8.64 U3.19
N$43
  Top 0.203: R18.2 R20.2 22.65,10.16 24.64,10.16 25.5,9.3 U3.18
N$44
  Top 0.203: U3.3 35.66,9.3 36.07,8.89 36.07,6.1 35.56,5.59 R25.1
N$45
  Top 0.203: U3.4 35.77,9.95 36.83,8.89 36.83,3.56 35.81,2.54 R28.1
N$46
  Top 0.203: U3.5 35.88,10.6 38.86,7.62 R29.1
N$47  (via drill 0.4)
  Top 0.203: U3.9 35.81,13.21 v37.08,14.48
  Top 0.254: R37.1 52.79,8.08 48.81,4.11 R33.2 47.5,4.32 44.96,6.86 43.4,6.86 C24.2 41.18,7.08 v41.15,7.11
  Bottom 0.254: v37.08,14.48 41.15,10.41 v41.15,7.11
N$48
  Top 0.203: U3.6 36,11.25 37.08,10.16 38.31,10.16 R36.2
  Top 0.254: R36.2 R35.2 46.98,10.2 C27.1 47.5,9.68 R33.1
N$49
  Top 0.203: U3.10 35.44,13.85 35.81,14.22 35.81,15.49 35.31,16 R34.2
N$50  (via drill 0.4)
  Top 0.254: CR1.2 70.17,13.9 69.3,14.78 R41.2 67.31,14.52 R42.2 67.27,11.18 v65.28,11.18 | R43.2 73.91,3.05 71.67,5.29 R46.2 v70.1,7.11 | R45.1 v91.44,2.79
  Bottom 0.254: v65.28,11.18 66.04,11.18 v70.1,7.11 74.42,2.79 v91.44,2.79
N$51
  Top 0.203: U1.4 59.69,80.01 61.72,77.98 R68.1
N$52
  Top 0.203: C28.1 79.25,11.4 79.25,9.14 80.22,8.17 R44.1
N$53
  Top 0.203: U11.1 103.67,42.2 | 103.67,42.2 102.11,40.64 102.11,38.91 R40.1 | U10.1 102.17,42.2 103.67,42.2
N$54  (via drill 0.4)
  Top 0.203: U8.2 42.04,23.24 v41.91,23.11 | U8.3 42.29,21.97 41.91,22.35 v41.91,23.11 | U8.1 42.29,24.51 41.91,24.13 v41.91,23.11
  Top 0.254: R37.2 R38.2 49.78,14.27 v49.78,16.26
  Bottom 0.254: v49.78,16.26 42.93,23.11 v41.91,23.11
N$55
  Top 0.203: D10.1 D11.1 39.41,30.77 38.35,29.72 36.07,29.72 33.53,27.18 23.37,27.18 22.1,25.91 L5.2
N$56  (via drill 0.4)
  Top 0.203: U9.1 27.69,24.39 26.92,23.62 D12.2 26.89,22.86 v25.65,22.86
  Top 0.254: C32.2 20.32,16 18.54,17.78 R21.2 16.72,19.26 v17.78,20.32
  Bottom 0.254: v17.78,20.32 20.32,22.86 v25.65,22.86
N$57
  Top 0.254: JP1.1 2.33,59.39 R62.2
N$58
  Top 0.254: CR1.3 71.12,9.4 69.89,8.17 R42.1 66.58,7.44 C33.2
N$59  (via drill 0.4)
  Top 0.203: U8.7 50.16,23.24 50.55,23.62 | U8.6 50.16,21.97 50.55,22.35 | U8.5 49.91,20.7 50.55,21.34 50.55,22.35 | 50.55,22.35 50.55,23.62 | 50.55,23.62 50.55,24.89 | 50.55,24.89 50.55,25.4 49.28,26.67 44.7,26.67 v43.43,27.94 | U8.8 50.16,24.51 50.55,24.89
  Top 0.254: C41.2 v43.43,27.94 | T1.3 48.18,37.08 46.23,37.08 45.47,36.32 v45.47,34.04 45.49,34.06 T1.4
  Bottom 0.254: v45.47,34.04 43.43,32 v43.43,27.94
N$60  (via drill 0.4)
  Top 0.203: D13.1 14.83,13.42 U7.2 v14.99,12.19 | U8.4 41.78,20.7 v41.66,20.57
  Bottom 0.254: v41.66,20.57 31.75,20.57 23.37,12.19 v14.99,12.19
N$61
  Top 0.254: C41.1 36.32,27.94 35.56,27.18 U9.2
N$62  (via drill 0.4)
  Top 0.203: U12.3 71.14,21.36 71.12,21.39 71.12,22.1 70.61,22.61 65.79,22.61 63.88,20.7 U6.2
  Top 0.254: CR1.1 72.07,14.67 72.64,15.24 C26.1 72.68,15.75 v71.12,15.75 69.85,17.02 69.85,20.83 70.38,21.36 71.14,21.36 | R43.1 78.95,4.11 77.26,5.8 R44.2 77.22,7.16 v77.22,9.14
  Bottom 0.254: v77.22,9.14 71.12,15.24 v71.12,15.75
N$63
  Top 0.203: U11.3 109,42.14 D9.2 109,34.58 107.58,33.16 Q6.4
N$64
  Top 0.254: R67.2 71.12,83.52 71.12,82.3 70.31,81.49 R66.2 70.31,78.95 69.34,77.98 68.33,77.98 | R68.2 68.33,77.98 | C2.1 69.56,76.74 68.33,77.98
N$65
  Top 0.203: 92.75,43.43 R39.1
  Top 0.305: C22.1 92.7,43.4 R39.1 94.53,43.39 95.5,42.42 96.67,42.42 U4.1 96.77,40.32 U5.1
N$66  (via drill 0.4)
  Top 0.203: R40.2 105.37,39.12 D9.1 107.4,42.16 U11.2
  Top 0.254: R40.2 105.16,38.82 v105.16,36.83 | Q5.5 v82.04,36.07
  Top 0.305: T1.10 78.46,37.06 Q5.5 81.46,40.06 79.57,40.06 | T1.11 79.57,40.06 | T1.12 76.57,43.06 79.57,40.06
  Bottom 0.254: v82.04,36.07 82.8,35.31 104.39,35.31 105.16,36.07 v105.16,36.83
N$68
  Top 0.203: R51.2 85.34,49.49 85.34,48.01 86.34,47.01 U13.5
N$70
  Top 0.203: U13.1 89.53,49.66 88.39,50.8 88.39,54.86 89.41,55.88 90.38,55.88 R49.1
  Top 0.254: R49.1 93.17,55.84 96.52,59.18 96.52,62.74 98.63,64.85 L6.2
N$71
  Top 0.254: C43.2 94.23,52.32 | 94.23,52.32 90.98,52.32 R49.2 | C42.1 95,55.88 94.23,55.12 94.23,52.32
N$73
  Top 0.203: C43.1 97.54,52.29 97.54,50.55 95,48.01 U13.8
  Top 0.254: 97.54,52.29 98.03,52.79 R53.2 102.11,60.15 R50.1
N$74
  Top 0.203: U13.4 89.52,47.5 87.31,47.5 86.61,48.19 86.61,52.32 85.85,53.09 C44.2
N$75
  Top 0.203: U13.3 88.14,48.01 87.38,48.77 87.38,55.63 86.36,56.64 R52.2
N$76
  Top 0.254: R56.1 75.44,61.47 LED4.2
N$77
  Top 0.254: C54.2 91.03,59.98 U14.1
N$78
  Top 0.254: U14.14 93.94,93.22 R55.2
N$79
  Top 0.254: R57.1 74.42,65.02 LED5.2
N$88
  Top 0.305: R61.1 14.52,55.58 LED1.2
N$89
  Top 0.305: R60.1 20.83,51.05 LED2.2
N_INT
  Top 0.305: J4.3 105.16,83.06 105.16,75.95 102.36,73.15 95.76,73.15 90.81,68.2 U14.4
OSC1
  Top 0.254: U14.23 82.93,73.03 80.48,75.48 Y1.1 79.08,78.6 C53.2
OSC2
  Top 0.254: Y1.3 76.96,73.79 76.96,72.64 78.23,71.37 | U14.24 81.92,71.37 78.23,71.37 | C52.2 76.49,70.9 76.96,71.37 78.23,71.37
OUT
  Top 0.203: U3.15 26.09,11.25 24.64,12.7 R22.1
PG  (via drill 0.4)
  Top 0.203: U13.7 93.21,47.51 v93.47,47.24 | R48.1 v55.12,50.8 | U2.13 25.65,38.86 26.67,37.85 v26.67,35.81
  Top 0.254: R26.1 24.38,33.53 v26.67,35.81
  Bottom 0.254: v93.47,47.24 92.46,46.23 87.38,46.23 85.34,48.26 56.39,48.26 55.12,49.53 v55.12,50.8 38.86,50.8 26.67,38.61 v26.67,35.81
PR12  (via drill 0.4)
  Top 0.254: Q1.3 38.86,75.44 39.62,76.2 40.39,76.2 | 40.39,76.2 U1.24 v44.7,76.2 | R10.2 30.23,78.49 31.24,77.47 39.12,77.47 40.39,76.2
  Top 0.305: C6.2 34.8,64.26 v35.31,64.77 36.07,65.53 D1.2
  Bottom 0.305: v44.7,76.2 35.31,66.8 v35.31,64.77
PR36  (via drill 0.4)
  Top 0.254: Q2.3 39.62,80.77 40.39,80.01 U1.21 v44.7,80.01
  Top 0.305: D2.2 v42.67,65.02 44.7,65.02 45.21,64.52 C7.2 | R9.2 v29.97,77.47
  Bottom 0.305: v44.7,80.01 46.23,80.01 47.24,78.99 47.24,69.6 v42.67,65.02 42.67,64.52 41.91,63.75 33.27,63.75 29.97,67.06 v29.97,77.47
PR45  (via drill 0.4)
  Top 0.254: R12.2 30.52,90.93 34.29,90.93 36.58,88.65 36.58,86.75 Q3.3 37.85,86.61 40.64,83.82 U1.18 v44.96,83.82
  Top 0.305: C8.2 52.07,64.26 51.05,65.28 v49.28,65.28 D3.2
  Bottom 0.305: v44.96,83.82 46.99,83.82 49.28,81.53 v49.28,65.28
PR78  (via drill 0.4)
  Top 0.254: Q4.3 37.34,93.22 38.86,91.69 38.86,89.66 40.89,87.63 U1.15 v44.96,87.63 | R11.2 v30.23,84.33
  Top 0.305: D4.2 v55.37,65.28 57.4,65.28 58.67,64.01 C9.2
  Bottom 0.254: v30.23,84.33 42.67,84.33 44.96,86.61 v44.96,87.63
  Bottom 0.305: v44.96,87.63 55.37,77.22 v55.37,65.28
RESET_ETH
  Top 0.305: R58.2 91.78,82.09 U14.10
  Bottom 0.305: U14.10 92.08,84.33 103.89,84.33 J4.2
RTN  (via drill 0.4)
  Top 0.203: U3.13 27.08,12.55 v26.92,12.7 | U3.8 35.97,12.55 v36.07,12.45 | D11.2 v36.58,32 | U2.12 25.03,38.21 v25.65,37.59 | U2.11 24.17,37.05 v25.15,36.07 | D12.1 26.92,20.32 27.43,19.81 v27.69,19.81 | U7.3 17.27,13.97 v17.27,13.21
  Top 0.254: R38.1 v53.85,14.22 | C27.2 v46.99,14.48 | C57.1 v55.88,15.75 | C56.1 v55.88,11.43 | C55.1 v55.88,7.11 | C24.1 v43.18,2.79 | R29.2 v38.86,3.05 | v29.97,5.59 R25.2 | R28.2 v29.97,2.54 | R19.1 v22.61,5.84 R20.1 | C25.1 v14.48,4.32 | R34.1 v29.21,16 | U9.3 v27.69,19.81 | C30.1 v19.81,19.05 | R21.1 v12.45,17.78 | C20.2 v5.33,32.77 | T1.6 48.09,27.94 v45.97,27.94 | U6.3 54.74,20.7 v54.61,20.83 | v2.03,16.26 3.95,16.26 C23.2 | C34.1 v34.29,29.97 | C36.1 v45.72,55.63 | C37.1 v45.47,51.56 | C35.1 v39.37,55.63 | C17.1 v34.04,38.61 | C18.1 v34.29,35.05 | v55.88,2.79 C39.1
  pour Route2: 0.76,1.02 57.4,1.02 57.4,59.94 0.76,59.94
RXD_N  (via drill 0.4)
  Top 0.203: v66.8,83.57 65.79,82.55 U1.6
  Top 0.305: R67.1 v66.8,83.57
  Bottom 0.305: v66.8,83.57 66.8,84.84 73.91,91.95 87.12,91.95 90.81,88.27 U14.12
RXD_P  (via drill 0.4)
  Top 0.203: U1.5 65.02,81.28 v65.79,80.52
  Top 0.305: R66.1 67.1,80.52 v65.79,80.52
  Bottom 0.305: v65.79,80.52 65.79,86.11 74.17,94.49 87,94.49 U14.13
SPI_MISO
  Bottom 0.305: U14.6 103.89,72.9 105.41,71.37 J10.1
SPI_MOSI
  Bottom 0.305: U14.7 103.63,75.44 105.41,73.66 107.95,73.66 J10.2
SPI_SCLK
  Bottom 0.305: U14.8 103.89,77.98 105.41,76.45 J10.3
SS
  Top 0.203: U3.12 27.44,13.2 26.16,14.48 26.16,18.54 25.65,19.05 C30.2
  Top 0.305: R26.2 24.38,19.08 C30.2
TPH
  Top 0.203: U2.18 21.84,45.72 LED1.1
TPL
  Top 0.203: U2.17 22.49,46.85 LED2.1
TXD_CT
  Top 0.203: U1.1 57.15,74.17 60.2,71.12 61.42,71.12 R64.2
  Top 0.254: R64.2 61.47,69.85 62.48,68.83 66.5,68.83 R65.2 67.1,68.83 | 67.1,68.83 68.33,68.83 69.09,69.6 L7.1 | 67.1,68.83 66.85,68.83 66.8,68.79 C1.1
TXD_N  (via drill 0.4)
  Top 0.203: U1.3 v59.44,78.74
  Top 0.305: R65.1 65.58,72.09 59.44,78.23 v59.44,78.74
  Bottom 0.305: v59.44,78.74 68.07,78.74 80.01,90.68 U14.16
TXD_P  (via drill 0.4)
  Top 0.203: v59.69,76.45 58.67,77.47 U1.2
  Top 0.305: R64.1 60.24,74.12 59.69,74.68 v59.69,76.45
  Bottom 0.305: U14.17 81.28,88.14 69.6,76.45 v59.69,76.45
VC
  Top 0.203: U3.16 26.42,10.6 | 26.42,10.6 24.45,10.6 23.88,11.18 15.75,11.18 14.48,9.91 C25.2 | U3.17 27.07,9.95 26.42,10.6
  Top 0.254: C25.2 12.48,8.86 8.5,12.84 C23.1 8.5,22.98 11.43,25.91 L5.1
VC_IN
  Top 0.203: U2.15 26.89,40.16 28.45,38.61 C17.2
VC_OUT
  Top 0.203: U2.14 26.27,39.51 27.69,38.1 27.69,35.81 28.45,35.05 C18.2
VCOUT
  Top 0.305: R59.2 10.97,59.18 18.03,59.18 | R60.2 20.83,57.91 19.56,59.18 18.03,59.18 | R61.2 17.48,58.63 18.03,59.18
VDD  (via drill 0.4)
  Top 0.203: U3.1 35.05,7.29 v35.05,7.11 | U2.1 14.51,40.16 13.46,39.12 v13.46,34.04
  Top 0.254: R18.1 19.51,7.11 v17.78,7.11 | R17.1 17.82,4.78 v17.78,4.83 | C20.1 v5.33,20.07 | C19.2 v2.54,33.27 | R23.1 v15.24,33.27 | C34.2 v27.94,29.97 | C12.2 v30.48,53.34 | L1.1 33.34,53.28 v33.27,53.34
  Top 0.305: L4.2 v30.48,45.72
  pour Route15: 36.32,56.13 24.64,56.13 24.64,35.31 0.76,35.31 0.76,1.02 58.67,1.02 58.67,32.77 36.32,32.77
VDD_P  (via drill 0.4)
  Top 0.203: U13.2 88.91,48.51 v88.39,49.02
  Top 0.254: T1.1 45.84,43.06 v45.72,43.18 | T1.2 45.79,40.06 v45.72,40.13 | C37.2 v52.07,51.56 | TP11.TP v40.39,38.1 | C40.2 59.15,50.55 v57.4,50.55 | C36.2 50.51,55.88 v52.07,55.88 | R48.2 54.86,55.33 v54.86,56.39 | C3.2 v58.42,55.63 | C4.2 v67.56,55.37 | C46.2 68.87,50.8 v67.56,50.8 | C35.2 43.94,55.59 v43.94,53.34
  Top 0.305: L4.1 40.92,42.7 v40.89,42.67
  Bottom 0.254: v88.39,49.02 85.6,51.82 70.1,51.82 v68.83,53.09
  pour Route15: 70.1,58.17 70.1,48.51 60.2,48.51 60.2,34.29 37.85,34.29 37.85,58.17
VSS  (via drill 0.4)
  Top 0.203: U2.4 18.4,38.21 17.53,37.34 v17.27,37.34 | U2.5 19.02,37.56 v18.29,36.83 | U2.21 v18.8,41.91
  Top 0.254: C19.1 v2.54,39.62 | R32.1 v7.62,46.99 | R27.1 v11.43,46.99 | R24.1 v15.24,46.99 | R62.1 v6.6,55.37
  pour Route15: 23.37,36.32 0.76,36.32 0.76,62.23 23.37,62.23
VSS1  (via drill 0.4)
  Top 0.254: C12.1 30.23,58.13 v30.23,59.44 | v24.38,65.53 L2.1
  pour Route15: 17.78,63.25 24.64,63.25 24.64,57.15 33.02,57.15 33.02,69.85 17.78,69.85